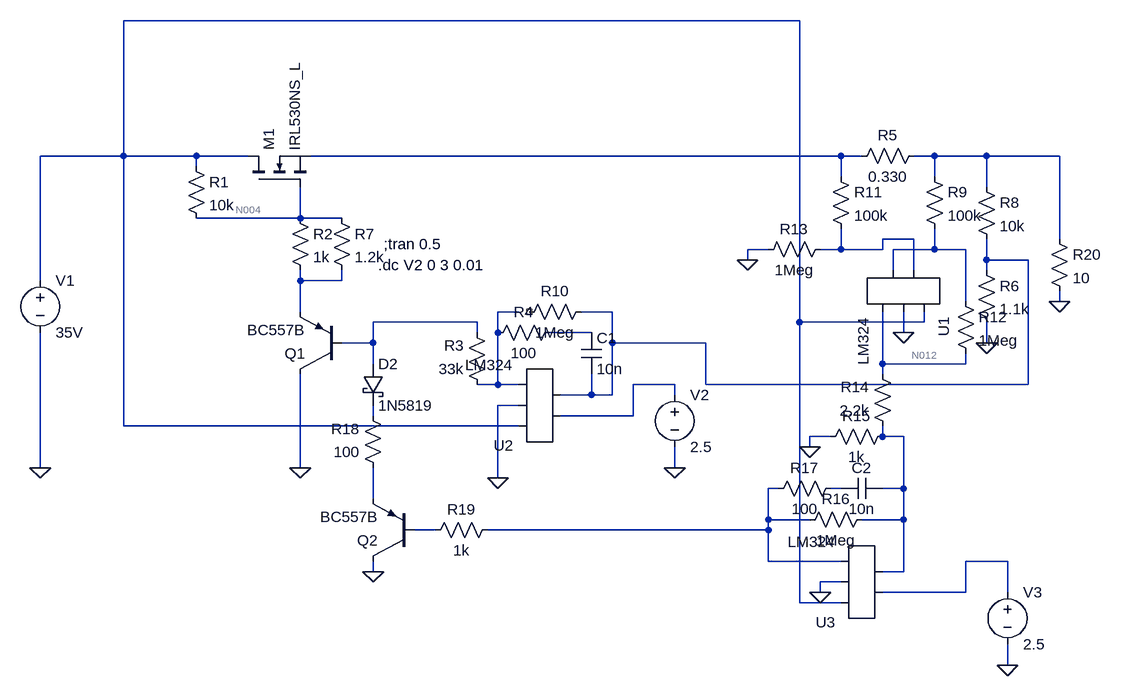
[diagram p0: schematic power.asc]
* power.asc
M1 N001 N004 N002 N002 IRL530NS_L
R1 N001 N004 10k
R2 N004 N008 1k
R3 N009 N010 33k
R4 N011 N009 100
C1 N011 N007 10n
R6 N007 0 1.1k
V1 N001 0 35V
V2 N013 0 2.5
R7 N004 N008 1.2k
R10 N007 NC_01 1Meg
Q1 0 N010 N008 0 BC557B
* U2: LM324 (symbol AutoGenerated\LM324 not available, pins judged from their places): pin1=N013 pin2=N007 pin3=N001 pin4=0 pin5=N009
R8 N003 N007 10k
R5 N003 N002 0.330
R9 N003 N006 100k
R11 N002 N005 100k
* U1: LM324 (symbol AutoGenerated\LM324 not available, pins judged from their places): pin1=N005 pin2=N006 pin3=N001 pin4=0 pin5=N012
R12 N006 N012 1Meg
R13 N005 0 1Meg
* U3: LM324 (symbol AutoGenerated\LM324 not available, pins judged from their places): pin1=N020 pin2=N015 pin3=N001 pin4=0 pin5=N016
R14 N015 N012 2.2k
R15 0 N015 1k
V3 N020 0 2.5
R16 N015 N016 1Meg
R17 N017 N016 100
C2 N015 N017 10n
D2 N010 N014 1N5819
R18 N018 N014 100
Q2 0 N019 N018 0 BC557B
R19 N016 N019 1k
R20 N003 0 10
.model D D
.lib standard.dio
.model NPN NPN
.model PNP PNP
.lib standard.bjt
.model NMOS NMOS
.model PMOS PMOS
.lib standard.mos
.dc V2 0 3 0.01
;tran 0.5
.backanno
.end

* Results of the author's LTspice run, read from the files saved beside the schematic
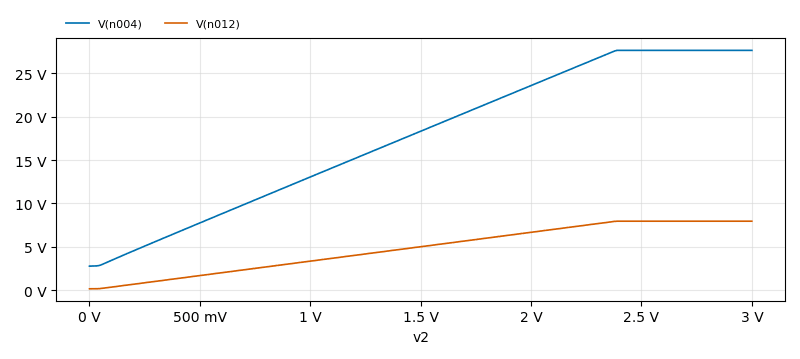
[diagram p1: DC transfer characteristic of power.asc, plotted from the saved traces]
* DC transfer characteristic, 1 run:
*   V(n004): 2.767 V at v2=0 V, 27.65 V at v2=3 V, min 2.767 V, max 27.65 V
*   V(n012): 153.6 mV at v2=0 V, 7.95 V at v2=3 V, min 153.6 mV, max 7.95 V